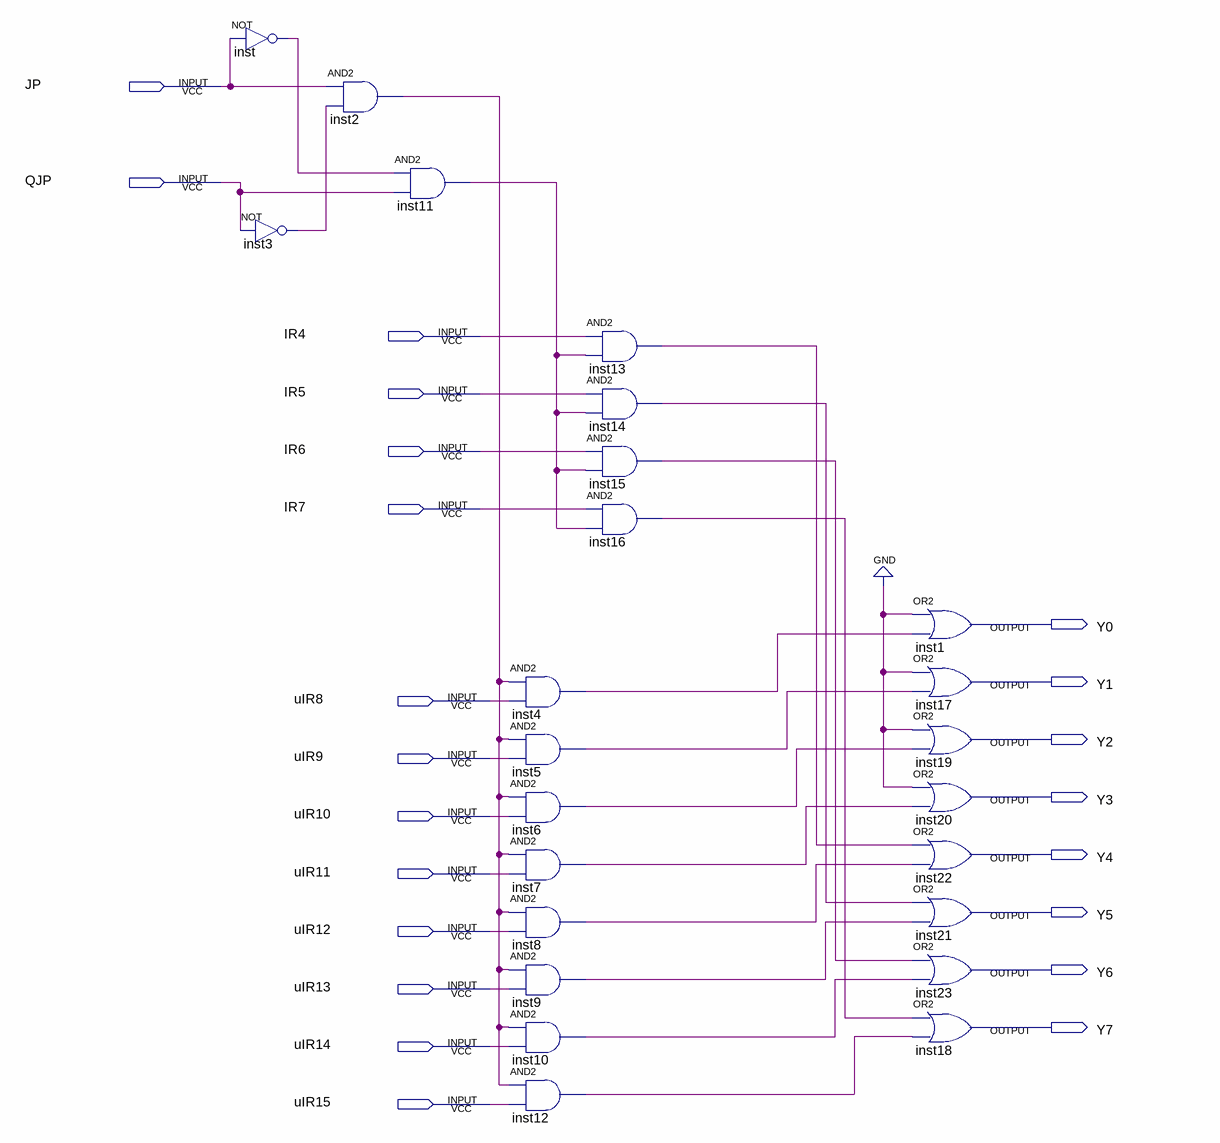
[diagram p0: schematic sheet]
// Quartus schematic JPQJP.bdf as structural Verilog: 24 symbols, 22 pins
module JPQJP (
  input  JP,
  input  QJP,
  input  IR4,
  input  IR5,
  input  IR6,
  input  IR7,
  input  uIR8,
  input  uIR9,
  input  uIR10,
  input  uIR11,
  input  uIR12,
  input  uIR13,
  input  uIR14,
  input  uIR15,
  output Y0,
  output Y1,
  output Y2,
  output Y3,
  output Y4,
  output Y5,
  output Y6,
  output Y7
);

  wire inst2_out, inst3_out, inst4_out, inst5_out, inst6_out, inst7_out, inst8_out, inst9_out, inst10_out,
       inst11_out, inst12_out, inst13_out, inst14_out, inst15_out, inst16_out, inst_out;

  not inst (inst_out, JP);
  not inst3 (inst3_out, QJP);
  and inst2 (inst2_out, JP, inst3_out);
  and inst11 (inst11_out, inst_out, QJP);
  and inst4 (inst4_out, inst2_out, uIR8);
  and inst5 (inst5_out, inst2_out, uIR9);
  and inst6 (inst6_out, inst2_out, uIR10);
  and inst7 (inst7_out, inst2_out, uIR11);
  and inst8 (inst8_out, inst2_out, uIR12);
  and inst9 (inst9_out, inst2_out, uIR13);
  and inst10 (inst10_out, inst2_out, uIR14);
  and inst12 (inst12_out, inst2_out, uIR15);
  and inst13 (inst13_out, IR4, inst11_out);
  and inst14 (inst14_out, IR5, inst11_out);
  and inst15 (inst15_out, IR6, inst11_out);
  and inst16 (inst16_out, IR7, inst11_out);
  or inst1 (Y0, 1'b0, inst4_out);
  or inst17 (Y1, 1'b0, inst5_out);
  or inst19 (Y2, 1'b0, inst6_out);
  or inst20 (Y3, 1'b0, inst7_out);
  or inst22 (Y4, inst13_out, inst8_out);
  or inst21 (Y5, inst14_out, inst9_out);
  or inst23 (Y6, inst15_out, inst10_out);
  or inst18 (Y7, inst16_out, inst12_out);
endmodule
